# EasyEDA Pro project ProPrj_Simagic qr wheelside adapter passive final_2025-09-28.epro

# Schematic Schematic1
Board Name: Board1; Create Date: 2025-05-08; Page Name: P1; Project Name: Simagic qr wheelside adapter; Schematic Name: Schematic1; Update Date: 2025-05-08; Company: EasyEDA.com; Page Size: A4; Version: V1.0
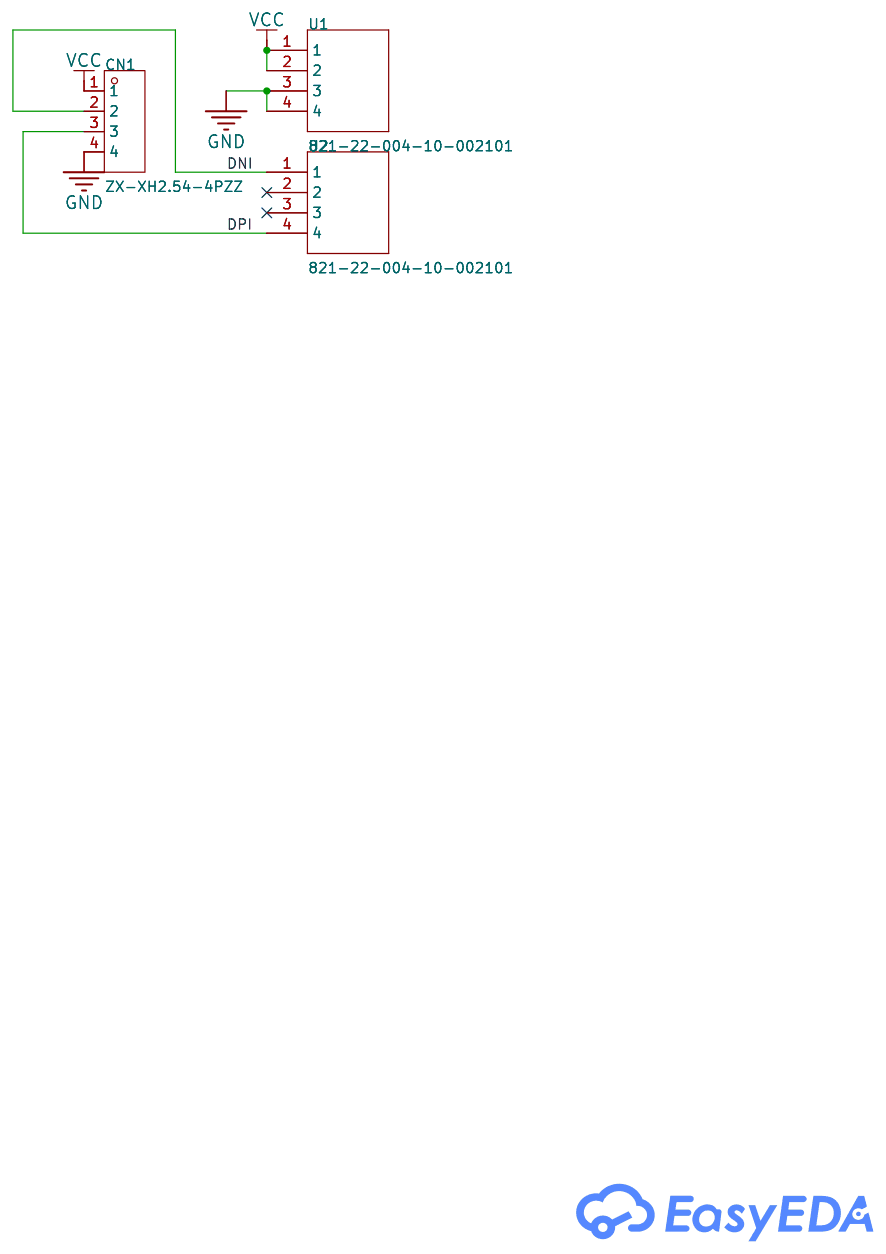
[diagram p0: schematic sheet]

## Parts
CN1  ZX-XH2.54-4PZZ  [CONN-TH_4P-P2.50_4PIN]
U1  821-22-004-10-002101  [HDRV4W43P0X254_1X4_1016X254X50]
U2  821-22-004-10-002101  [HDRV4W43P0X254_1X4_1016X254X50]

## Library data of the parts
CN1 = ZX-XH2.54-4PZZ: Pins Structure:1x4P Pitch:2.5mm Mounting Type:Direct Insert Reference Series:XH Number of Pins:4P Number of Rows:1 Number of PINs Per Row:4 Row Spacing:- Rated Current:3A Contact Material:Brass Contact Plating:Tin Operating Temperature:-25℃~+85℃ Operating; LCSC Part Name: 1x4P 间距:2.5mm 直插 系列:XH; Supplier Part: C7429634; Manufacturer: Megastar(兆星); Supplier Footprint: 插件,P=2.5mm; JLCPCB Part Class: Extended Part; Datasheet: https://atta.szlcsc.com/upload/public/pdf/source/20230619/B529A2163E0159A644AB3383D208FB03.pdf; Supplier: LCSC; Pins Structure: 1x4P; Pitch: 2.5mm; Mounting Type: Direct Insert; Reference Series: XH; Number of Pins: 4P; Number of Rows: 1; Number of PINs Per Row: 4; Rated Current: 3A; Contact Material: Brass; Contact Plating: Tin; Operating Temperature: -25℃~+85℃; Rated Voltage (Max): 250V; Plastic Material: PA66; Flame Retardant Rating: UL94V-0; Color: White; Z-Height of the Board: 7mm; X-Length of Bottom Edge on Board (Spacing Line): 12.5mm; Y-Width of Bottom Edge on Board: 5.9mm
U1 U2 = 821-22-004-10-002101

## Nets
GND: CN1.4 U1.3 U1.4
VCC: CN1.1 U1.1 U1.2
DNI: CN1.2 U2.1
DPI: CN1.3 U2.4

Not connected (* = marked no-connect by the designer): U2 2* 3*

# Board PCB5
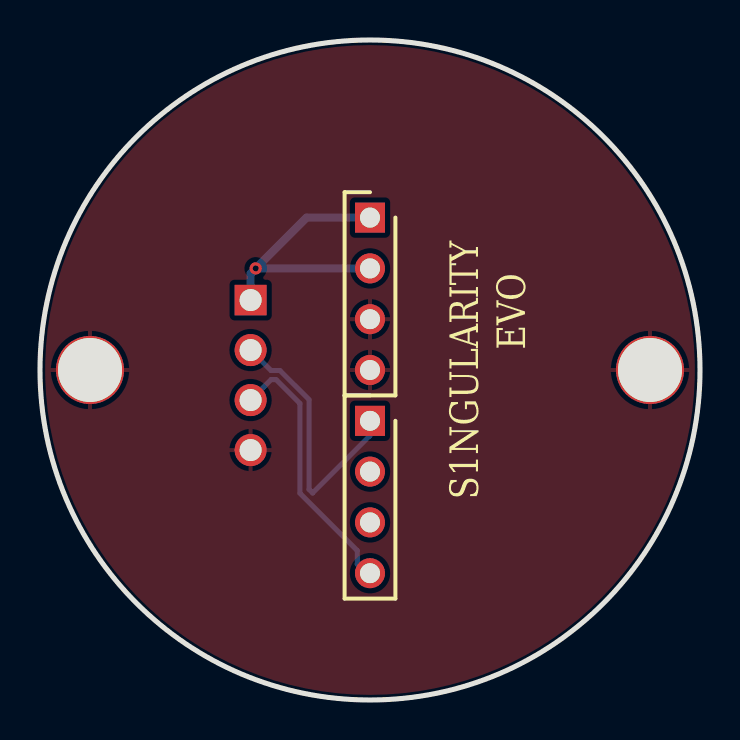
[diagram p1: board, top side]
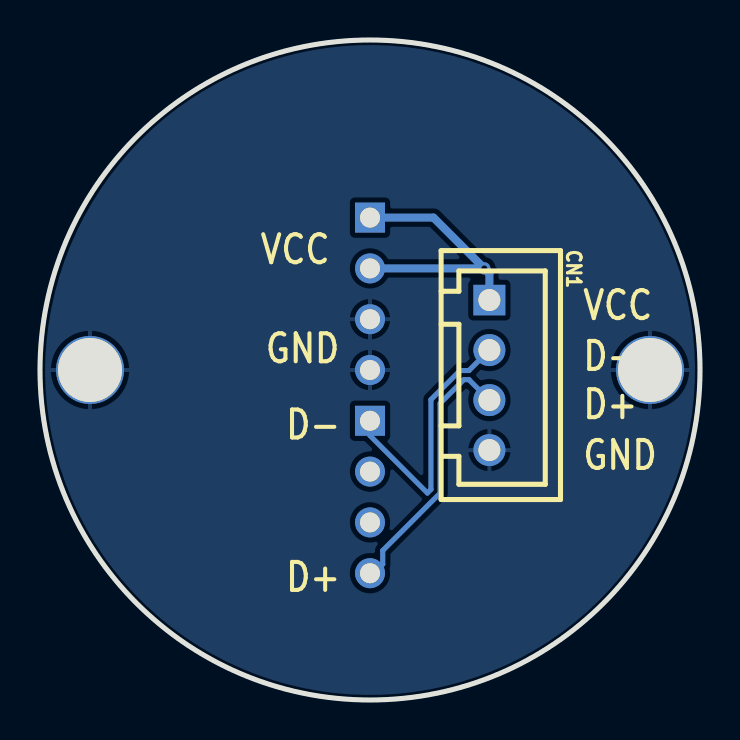
[diagram p2: board, bottom side, seen from below]

Outline 33 x 33 mm; copper layers: Top Layer, Bottom Layer. Coordinates in mm from the lower left corner of the outline.
Outline path: circle c16.5,16.5 r16.5
Stack: Top Layer 0.035mm / Dielectric1 1.51mm FR4 er 4.5 / Bottom Layer 0.035mm

## Design rules (mm)
net DPI: DP1
net DNI: DP1
template: Custom Config
spacing copperThickness1oz (default): track to track 0.102, other pairs 0.152 to 0.3
spacing copperThickness2oz: track to track 0.203, other pairs 0.152 to 0.3
track width copperThickness1oz (default): min 0.127, default 0.254, max 2.54
track width copperThickness2oz: min 0.203, default 0.254, max 2.54
differential pair differentialPair (default): width min 0.127, default 0.254, max 2.54; gap min 0.203, default 0.203
via viaSize (default): diameter min 0.5, default 0.61, max 10; hole min 0.3, default 0.305, max 6.3

## Placement (name value [footprint] x y rotation side)
CN1  ZX-XH2.54-4PZZ  [CONN-TH_4P-P2.50_4PIN]  10.53 16.25 270 bottom
NOREF  -  [Pad_e187]  30.5 16.5 0 top
NOREF#2  -  [HDRV4W43P0X254_1X4_1016X254X50]  16.5 13.96 270 top
NOREF#3  -  [Pad_e275]  2.5 16.5 0 top
U1  821-22-004-10-002101  [HDRV4W43P0X254_1X4_1016X254X50]  16.5 24.12 270 top

## Footprints (pads in the part's own frame, mm; a bottom-side part is the same pattern mirrored in y, then rotated)
CONN-TH_4P-P2.50_4PIN
  rect 1.524x1.6 hole 1.1: 1(-3.75,0)
  round 1.6 hole 1.1: 2(-1.25,0) 3(1.25,0) 4(3.75,0)
HDRV4W43P0X254_1X4_1016X254X50
  rect 1.5x1.5 hole 1: 1(0,0)
  round 1.5 hole 1: 2(2.54,0) 3(5.08,0) 4(7.62,0)
Pad_e187
  round 3.4 hole 3.2: 1(0,0)
Pad_e275
  round 3.4 hole 3.2: 2(0,0)

## Nets
GND: CN1.4 NOREF.1 NOREF#3.2 U1.3 U1.4
VCC: CN1.1 U1.1 U1.2
DNI: CN1.2 NOREF#2.1
DPI: CN1.3 NOREF#2.4

Pads without a net: NOREF#2 2 3

## Via types
v1: diameter 0.61, hole 0.305, Top Layer to Bottom Layer, 1 via

## Routing (per net, layer and track width the routed paths; a pad name or vN(x,y) marks a point on that pad's centre or on a via; arc(x,y) is an arc through that point)
VCC: length 14.2
  Bottom Layer w0.4: U1.2 v1(10.78,21.58) ; v1(10.78,21.58) 10.53,21.33 CN1.1 ; v1(10.78,21.58) 13.32,24.12 U1.1
DNI: length 13.5
  Bottom Layer w0.254: NOREF#2.1 16.5,13.22 13.63,10.35 13.45,10.53 13.45,15.02 12,16.47 11.55,16.47 CN1.2
DPI: length 13.4
  Bottom Layer w0.254: CN1.3 11.55,16.02 11.81,16.02 13,14.83 13,10.34 15.86,7.47 15.86,6.79 16.31,6.34 NOREF#2.4

## Copper pours and planes (outline as drawn; the poured copper is in the pictures)
GND on Top Layer: 33,16.9 32.96,17.71 32.88,18.52 32.76,19.32 32.6,20.12 32.4,20.9 32.17,21.68 31.89,22.44 31.58,23.19 31.24,23.92 30.86,24.63 30.44,25.33 29.99,26 29.51,26.65 28.99,27.28 28.45,27.88 27.88,28.45 27.28,28.99 26.65,29.51 26,29.99 25.33,30.44 24.63,30.86 23.92,31.24 23.19,31.58 22.44,31.89 21.68,32.17 20.9,32.4 20.12,32.6 19.32,32.76 18.52,32.88 17.71,32.96 16.9,33 16.1,33 15.29,32.96 14.48,32.88 13.68,32.76 12.88,32.6 12.1,32.4 11.32,32.17 10.56,31.89 9.81,31.58 9.08,31.24 8.37,30.86 7.67,30.44 7,29.99 6.35,29.51 5.72,28.99 5.12,28.45 4.55,27.88 4.01,27.28 3.49,26.65 3.01,26 2.56,25.33 2.14,24.63 1.76,23.92 1.42,23.19 1.11,22.44 0.83,21.68 0.6,20.9 0.4,20.12 0.24,19.32 0.12,18.52 0.04,17.71 0,16.9 0,16.1 0.04,15.29 0.12,14.48 0.24,13.68 0.4,12.88 0.6,12.1 0.83,11.32 1.11,10.56 1.42,9.81 1.76,9.08 2.14,8.37 2.56,7.67 3.01,7 3.49,6.35 4.01,5.72 4.55,5.12 5.12,4.55 5.72,4.01 6.35,3.49 7,3.01 7.67,2.56 8.37,2.14 9.08,1.76 9.81,1.42 10.56,1.11 11.32,0.83 12.1,0.6 12.88,0.4 13.68,0.24 14.48,0.12 15.29,0.04 16.1,0 16.9,0 17.71,0.04 18.52,0.12 19.32,0.24 20.12,0.4 20.9,0.6 21.68,0.83 22.44,1.11 23.19,1.42 23.92,1.76 24.63,2.14 25.33,2.56 26,3.01 26.65,3.49 27.28,4.01 27.88,4.55 28.45,5.12 28.99,5.72 29.51,6.35 29.99,7 30.44,7.67 30.86,8.37 31.24,9.08 31.58,9.81 31.89,10.56 32.17,11.32 32.4,12.1 32.6,12.88 32.76,13.68 32.88,14.48 32.96,15.29 33,16.1
GND on Bottom Layer: 32.74,16.78 32.7,17.59 32.62,18.39 32.5,19.19 32.35,19.99 32.15,20.77 31.91,21.55 31.64,22.31 31.33,23.06 30.98,23.79 30.6,24.51 30.19,25.2 29.74,25.87 29.25,26.52 28.74,27.15 28.2,27.75 27.62,28.32 27.02,28.87 26.4,29.38 25.75,29.86 25.07,30.31 24.38,30.73 23.66,31.11 22.93,31.46 22.18,31.77 21.42,32.04 20.65,32.28 19.86,32.47 19.07,32.63 18.27,32.75 17.46,32.83 16.65,32.87 15.84,32.87 15.03,32.83 14.23,32.75 13.43,32.63 12.63,32.47 11.85,32.28 11.07,32.04 10.31,31.77 9.56,31.46 8.83,31.11 8.11,30.73 7.42,30.31 6.75,29.86 6.09,29.38 5.47,28.87 4.87,28.32 4.3,27.75 3.75,27.15 3.24,26.52 2.76,25.87 2.31,25.2 1.89,24.51 1.51,23.79 1.16,23.06 0.85,22.31 0.58,21.55 0.34,20.77 0.15,19.99 -0.01,19.19 -0.13,18.39 -0.21,17.59 -0.25,16.78 -0.25,15.97 -0.21,15.16 -0.13,14.35 -0.01,13.55 0.15,12.76 0.34,11.97 0.58,11.2 0.85,10.43 1.16,9.69 1.51,8.95 1.89,8.24 2.31,7.55 2.76,6.87 3.24,6.22 3.75,5.6 4.3,5 4.87,4.42 5.47,3.88 6.09,3.37 6.75,2.88 7.42,2.43 8.11,2.02 8.83,1.63 9.56,1.29 10.31,0.98 11.07,0.71 11.85,0.47 12.63,0.27 13.43,0.12 14.23,0 15.03,-0.08 15.84,-0.12 16.65,-0.12 17.46,-0.08 18.27,0 19.07,0.12 19.86,0.27 20.65,0.47 21.42,0.71 22.18,0.98 22.93,1.29 23.66,1.63 24.38,2.02 25.07,2.43 25.75,2.88 26.4,3.37 27.02,3.88 27.62,4.42 28.2,5 28.74,5.6 29.25,6.22 29.74,6.87 30.19,7.55 30.6,8.24 30.98,8.95 31.33,9.69 31.64,10.43 31.91,11.2 32.15,11.97 32.35,12.76 32.5,13.55 32.62,14.35 32.7,15.16 32.74,15.97

## Text on the board
Bottom Silkscreen Layer: VCC | D- | D+ | GND
Top Silkscreen Layer: S1NGULARITY / EVO
